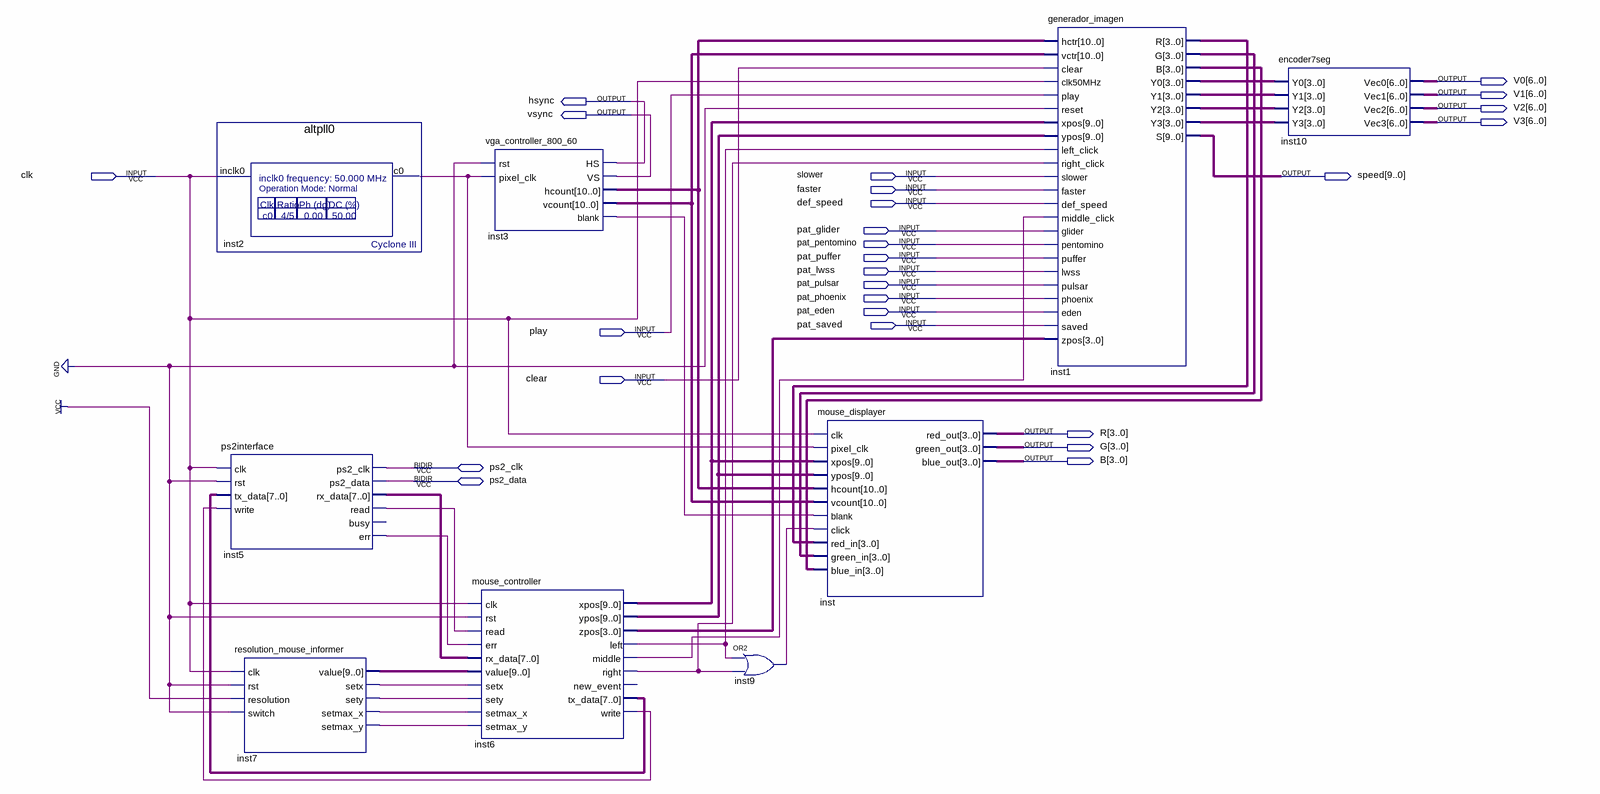
[diagram p0: schematic sheet]
// Quartus schematic game_of_life.bdf as structural Verilog: 9 symbols, 26 pins
module game_of_life (
  input  clk,
  input  slower,
  input  faster,
  input  def_speed,
  input  pat_glider,
  input  pat_pentomino,
  input  pat_puffer,
  input  pat_lwss,
  input  pat_pulsar,
  input  pat_phoenix,
  input  pat_eden,
  input  pat_saved,
  input  play,
  input  clear,
  inout  ps2_clk,
  inout  ps2_data,
  output [6:0] V0,
  output [6:0] V1,
  output hsync,
  output [6:0] V2,
  output vsync,
  output [6:0] V3,
  output [9:0] speed,
  output [3:0] R,
  output [3:0] G,
  output [3:0] B
);

  wire inst2_c0, inst3_blank, inst5_err, inst5_read, inst6_left, inst6_middle, inst6_right, inst6_write,
       inst7_setmax_x, inst7_setmax_y, inst7_setx, inst7_sety, inst9_out;
  wire [3:0] inst1_b, inst1_g, inst1_r, inst1_y0, inst1_y1, inst1_y2, inst1_y3, inst6_zpos;
  wire [7:0] inst5_rx_data, inst6_tx_data;
  wire [9:0] inst6_xpos, inst6_ypos, inst7_value;
  wire [10:0] inst3_hcount, inst3_vcount;

  altpll0 inst2 (.inclk0(clk), .c0(inst2_c0));
  ps2interface inst5 (
    .clk(clk), .rst(1'b0), .tx_data(inst6_tx_data), .write(inst6_write), .rx_data(inst5_rx_data),
    .read(inst5_read), .err(inst5_err), .ps2_clk(ps2_clk), .ps2_data(ps2_data));  // open: busy
  resolution_mouse_informer inst7 (
    .clk(clk), .rst(1'b0), .resolution(1'b1), .switch(1'b0), .value(inst7_value), .setx(inst7_setx),
    .sety(inst7_sety), .setmax_x(inst7_setmax_x), .setmax_y(inst7_setmax_y));
  vga_controller_800_60 inst3 (
    .rst(1'b0), .pixel_clk(inst2_c0), .HS(hsync), .VS(vsync), .hcount(inst3_hcount), .vcount(inst3_vcount),
    .blank(inst3_blank));
  mouse_controller inst6 (
    .clk(clk), .rst(1'b0), .read(inst5_read), .err(inst5_err), .rx_data(inst5_rx_data), .value(inst7_value),
    .setx(inst7_setx), .sety(inst7_sety), .setmax_x(inst7_setmax_x), .setmax_y(inst7_setmax_y),
    .xpos(inst6_xpos), .ypos(inst6_ypos), .zpos(inst6_zpos), .left(inst6_left), .middle(inst6_middle),
    .right(inst6_right), .tx_data(inst6_tx_data), .write(inst6_write));  // open: new_event
  or inst9 (inst9_out, inst6_left, inst6_right);
  mouse_displayer inst (
    .clk(clk), .pixel_clk(inst2_c0), .xpos(inst6_xpos), .ypos(inst6_ypos), .hcount(inst3_hcount),
    .vcount(inst3_vcount), .blank(inst3_blank), .click(inst9_out), .red_in(inst1_r), .green_in(inst1_g),
    .blue_in(inst1_b), .red_out(R), .green_out(G), .blue_out(B));
  generador_imagen inst1 (
    .hctr(inst3_hcount), .vctr(inst3_vcount), .clear(clear), .clk50MHz(clk), .play(play), .reset(1'b0),
    .xpos(inst6_xpos), .ypos(inst6_ypos), .left_click(inst6_left), .right_click(inst6_right),
    .slower(slower), .faster(faster), .def_speed(def_speed), .middle_click(inst6_middle),
    .glider(pat_glider), .pentomino(pat_pentomino), .puffer(pat_puffer), .lwss(pat_lwss),
    .pulsar(pat_pulsar), .phoenix(pat_phoenix), .eden(pat_eden), .saved(pat_saved), .zpos(inst6_zpos),
    .R(inst1_r), .G(inst1_g), .B(inst1_b), .Y0(inst1_y0), .Y1(inst1_y1), .Y2(inst1_y2), .Y3(inst1_y3),
    .S(speed));
  encoder7seg inst10 (
    .Y0(inst1_y0), .Y1(inst1_y1), .Y2(inst1_y2), .Y3(inst1_y3), .Vec0(V0), .Vec1(V1), .Vec2(V2), .Vec3(V3));
endmodule
